# EAGLE schematic PDNode-600 Pro (EAGLE 9.2.1), part 2 of 2
## Sheet 10 of 12: USB-C PD SOURCE PORT6
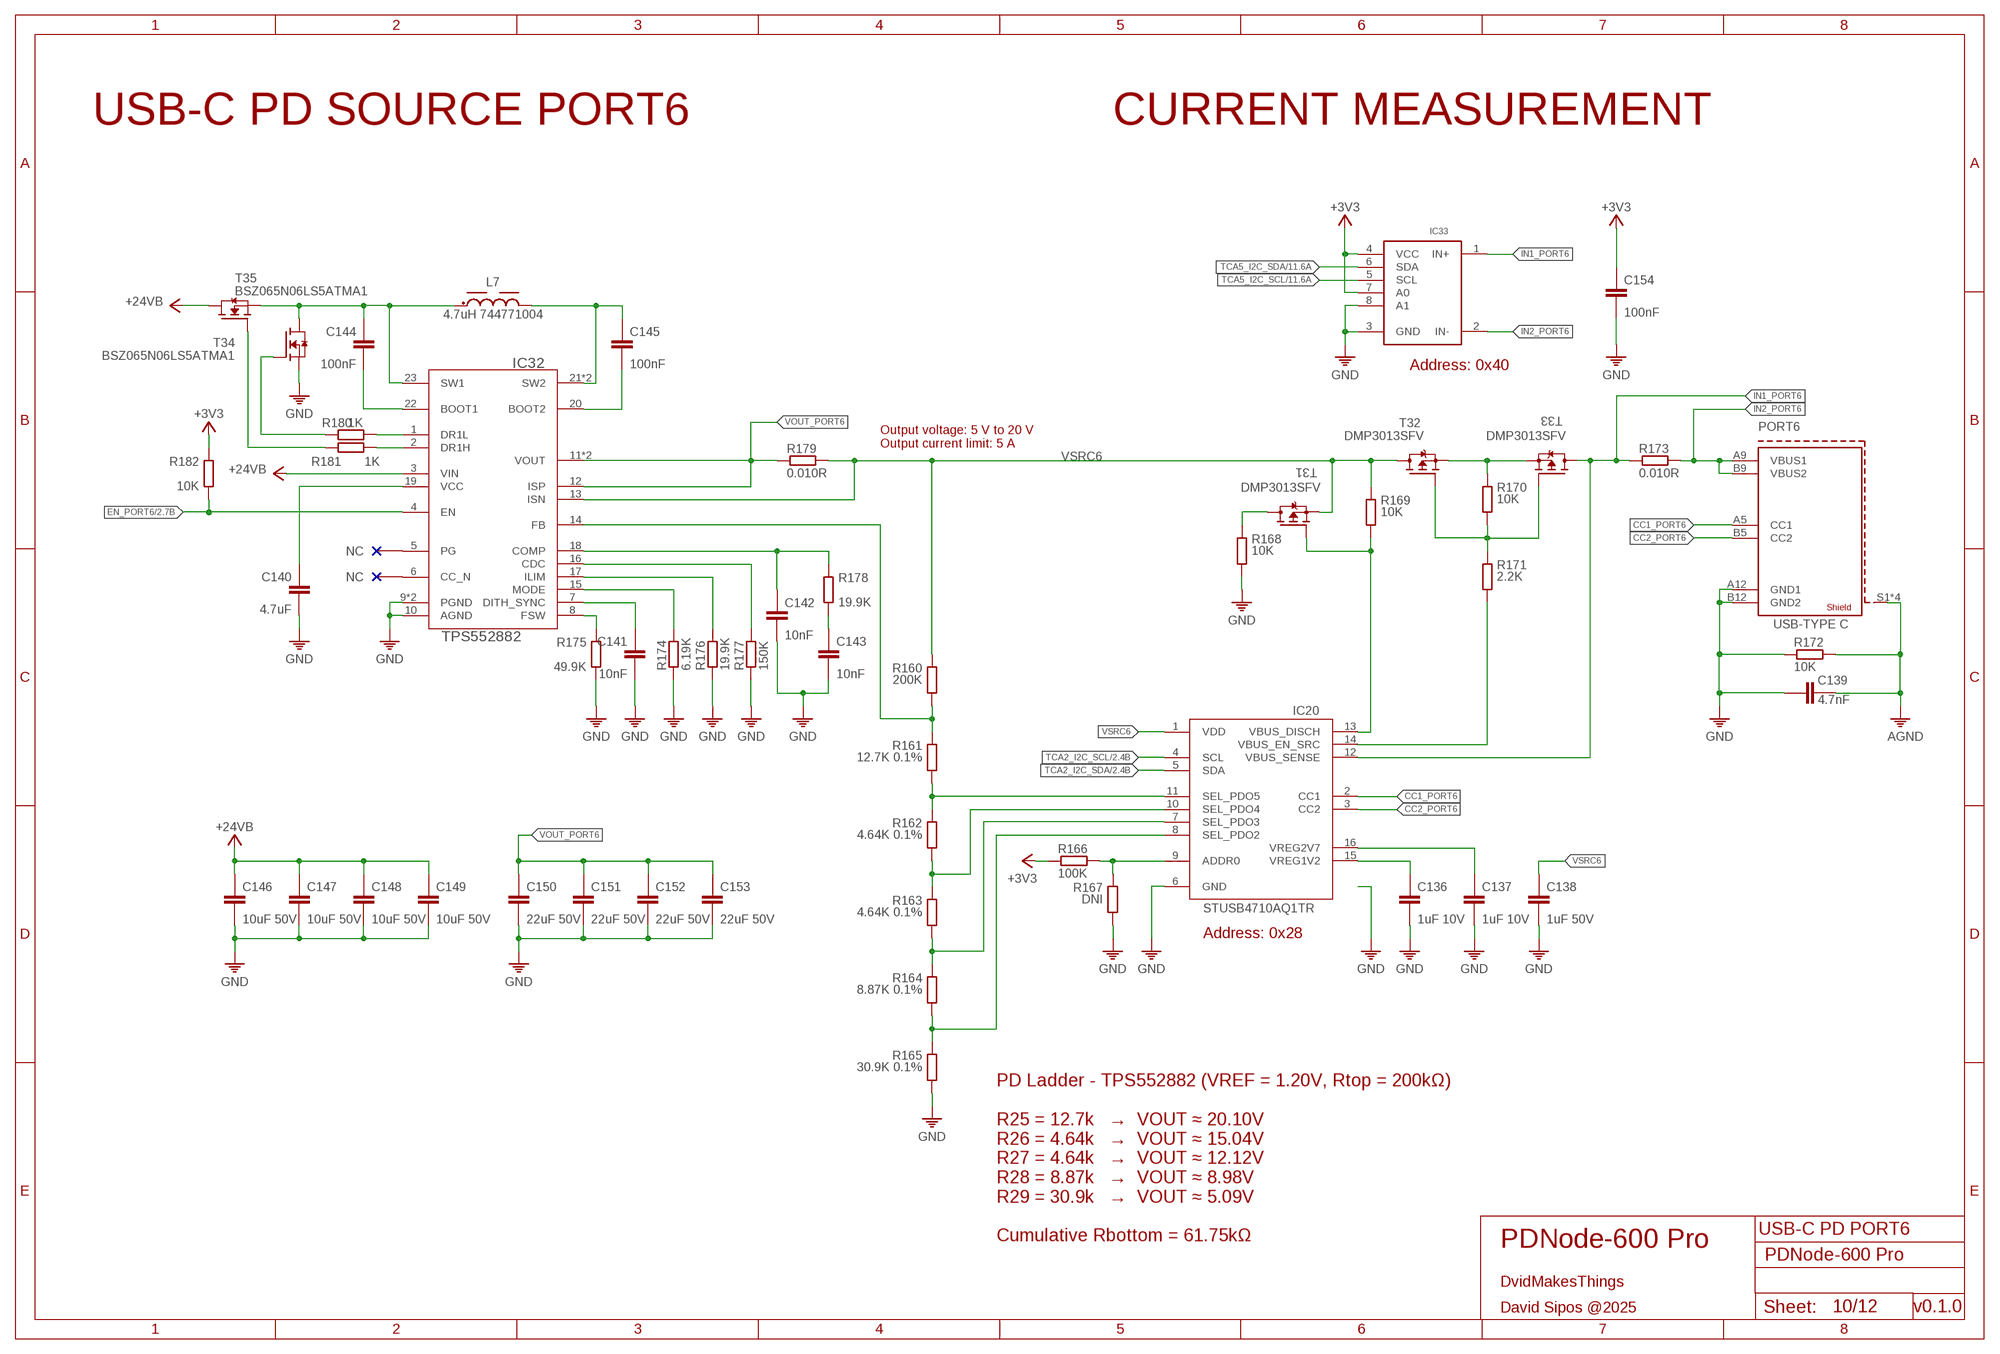
[diagram p9: schematic, sheet 10]

### Parts
C136  1uF 10V  C-0201  [0201]
C137  1uF 10V  C-0201  [0201]
C138  1uF 50V  C-0603  [C0603]
C139  4.7nF  C-0402  [C0402]
C140  4.7uF  C-0402  [C0402]
C141  10nF  C-0201  [0201]
C142  10nF  C-0201  [0201]
C143  10nF  C-0201  [0201]
C144  100nF  C-0402  [C0402]
C145  100nF  C-0402  [C0402]
C146  10uF 50V  C-0805  [C0805]
C147  10uF 50V  C-0805  [C0805]
C148  10uF 50V  C-0805  [C0805]
C149  10uF 50V  C-0805  [C0805]
C150  22uF 50V  C-0805  [C0805]
C151  22uF 50V  C-0805  [C0805]
C152  22uF 50V  C-0805  [C0805]
C153  22uF 50V  C-0805  [C0805]
C154  100nF  C-0201  [0201]
IC20  STUSB4710AQ1TR  [QFN50P300X300X55-16N]
IC32  TPS552882  [RPM0026A-MFG]
IC33  INA219BIDCNT  [SOT23-8]
L7  4.7uH 744771004  WE-PD_1280_74477004  [WE-PD_1280]
PORT6  632722100213  [632722100213]
R160  200K  R0201  [R0201]
R161  12.7K 0.1%  R0201  [R0201]
R162  4.64K 0.1%  R0201  [R0201]
R163  4.64K 0.1%  R0201  [R0201]
R164  8.87K 0.1%  R0201  [R0201]
R165  30.9K 0.1%  R0201  [R0201]
R166  100K  R0201  [R0201]
R167  DNI  R0201  [R0201]
R168  10K  R0402  [0402]
R169  10K  R0402  [0402]
R170  10K  R0201  [R0201]
R171  2.2K  R0201  [R0201]
R172  10K  R0402  [0402]
R173  0.010R  R2512  [2512]
R174  6.19K  R0201  [R0201]
R175  49.9K  R0201  [R0201]
R176  19.9K  R0201  [R0201]
R177  150K  R0201  [R0201]
R178  19.9K  R0201  [R0201]
R179  0.010R  R2512  [2512]
R180  1K  R0201  [R0201]
R181  1K  R0201  [R0201]
R182  10K  R0201  [R0201]
T31  DMP3013SFV  DMP3013SFV-7UX  [POWERDI3333-8_UX_DIO-L]
T32  DMP3013SFV  DMP3013SFV-7UX  [POWERDI3333-8_UX_DIO-L]
T33  DMP3013SFV  DMP3013SFV-7UX  [POWERDI3333-8_UX_DIO-L]
T34  BSZ065N06LS5ATMA1  IPZ40N04S5L7R4ATMA1  [POWERDI3333-8_UX_DIO-L]
T35  BSZ065N06LS5ATMA1  IPZ40N04S5L7R4ATMA1  [POWERDI3333-8_UX_DIO-L]

### Nets
+3V3: C154.1 IC33.4(VCC) IC33.7(A0) R166.1 R182.1 ; also sheet 1,2,3,4,5,6,7,8,9,11,12
+24V_B: C146.1 C147.1 C148.1 C149.1 IC32.3(VIN) T35.5(D) T35.6(D) T35.7(D) T35.8(D) T35.9(D) ; supply symbol labelled +24VB ; also sheet 3,9,11,12
AGND: C139.2 PORT6.S1(SHIELD1) PORT6.S2(SHIELD1) PORT6.S3(SHIELD1) PORT6.S4(SHIELD1) R172.2 ; also sheet 1,2,4,5,6,7,8,9,11,12
CC1_PORT6: IC20.2(CC1) PORT6.A5(CC1)
CC2_PORT6: IC20.3(CC2) PORT6.B5(CC2)
EN_PORT6: IC32.4(EN) R182.2 ; also sheet 2
GND: C136.2 C137.2 C138.2 C139.1 C140.2 C141.2 C142.2 C143.2 C146.2 C147.2 C148.2 C149.2 C150.2 C151.2 C152.2 C153.2 C154.2 IC20.6(GND) IC32.9(PGND) IC32.10(AGND) IC32.24(PGND) IC33.3(GND) IC33.8(A1) PORT6.A12(GND1) PORT6.B12(GND2) R165.2 R167.2 R168.2 R172.1 R174.2 R175.2 R176.2 R177.2 T34.1(S) T34.2(S) T34.3(S) ; also sheet 1,2,3,4,5,6,7,8,9,11,12
IN1_PORT6: IC20.12(VBUS_SENSE) IC33.1(IN+) R173.1 T33.5(D) T33.6(D) T33.7(D) T33.8(D) T33.9(D)
IN2_PORT6: IC33.2(IN-) PORT6.A9(VBUS1) PORT6.B9(VBUS2) R173.2
N$192: IC32.14(FB) R160.2 R161.1
N$193: IC20.11(SEL_PDO5) R161.2 R162.1
N$194: IC20.10(SEL_PDO4) R162.2 R163.1
N$195: IC20.7(SEL_PDO3) R163.2 R164.1
N$196: IC20.8(SEL_PDO2) R164.2 R165.1
N$197: C136.1 IC20.15(VREG1V2)
N$198: C137.1 IC20.16(VREG2V7)
N$199: IC20.9(ADDR0) R166.2 R167.1
N$200: R168.1 T31.5(D) T31.6(D) T31.7(D) T31.8(D) T31.9(D)
N$201: IC20.13(VBUS_DISCH) R169.2 T31.4(G)
N$202: R170.1 T32.1(S) T32.2(S) T32.3(S) T33.1(S) T33.2(S) T33.3(S)
N$203: R170.2 R171.1 T32.4(G) T33.4(G)
N$204: IC20.14(VBUS_EN_SRC) R171.2
N$205: C143.1 R178.2
N$206: IC32.8(FSW) R175.1
N$207: C141.1 IC32.7(DITH_SYNC)
N$208: IC32.15(MODE) R174.1
N$209: IC32.17(ILIM) R176.1
N$210: IC32.16(CDC) R177.1
N$211: C142.1 IC32.18(COMP) R178.1
N$212: C140.1 IC32.19(VCC)
N$213: C144.1 IC32.23(SW1) L7.1 T34.5(D) T34.6(D) T34.7(D) T34.8(D) T34.9(D) T35.1(S) T35.2(S) T35.3(S)
N$214: C145.1 IC32.21(SW2) IC32.25(SW2) L7.2
N$215: C144.2 IC32.22(BOOT1)
N$216: C145.2 IC32.20(BOOT2)
N$217: R181.2 T35.4(G)
N$218: R180.2 T34.4(G)
N$219: IC32.1(DR1L) R180.1
N$220: IC32.2(DR1H) R181.1
TCA2_I2C_SCL: IC20.4(SCL) ; also sheet 2,9
TCA2_I2C_SDA: IC20.5(SDA) ; also sheet 2,9
TCA5_I2C_SCL: IC33.5(SCL) ; also sheet 2,9,11,12
TCA5_I2C_SDA: IC33.6(SDA) ; also sheet 2,9,11,12
VOUT_PORT6: C150.1 C151.1 C152.1 C153.1 IC32.11(VOUT) IC32.12(ISP) IC32.26(VOUT) R179.1
VSRC6: C138.1 IC20.1(VDD) IC32.13(ISN) R160.1 R169.1 R179.2 T31.1(S) T31.2(S) T31.3(S) T32.5(D) T32.6(D) T32.7(D) T32.8(D) T32.9(D)
Unconnected: IC32.5(PG) IC32.6(CC_N)

### Notes on the sheet
- USB-C PD SOURCE PORT6 | CURRENT MEASUREMENT
- Address: 0x40
- Output voltage: 5 V to 20 V
  Output current limit: 5 A
- Address: 0x28
- USB-C PD PORT6
- PDNode-600 Pro
- PD Ladder - TPS552882 (VREF = 1.20V, Rtop = 200kΩ)
  
  R25 = 12.7k   →  VOUT ≈ 20.10V
  R26 = 4.64k   →  VOUT ≈ 15.04V
  R27 = 4.64k   →  VOUT ≈ 12.12V
  R28 = 8.87k   →  VOUT ≈ 8.98V
  R29 = 30.9k   →  VOUT ≈ 5.09V
  
  Cumulative Rbottom = 61.75kΩ
- DvidMakesThings
- David Sipos @2025 | v0.1.0

## Sheet 11 of 12: USB-C PD SOURCE PORT7
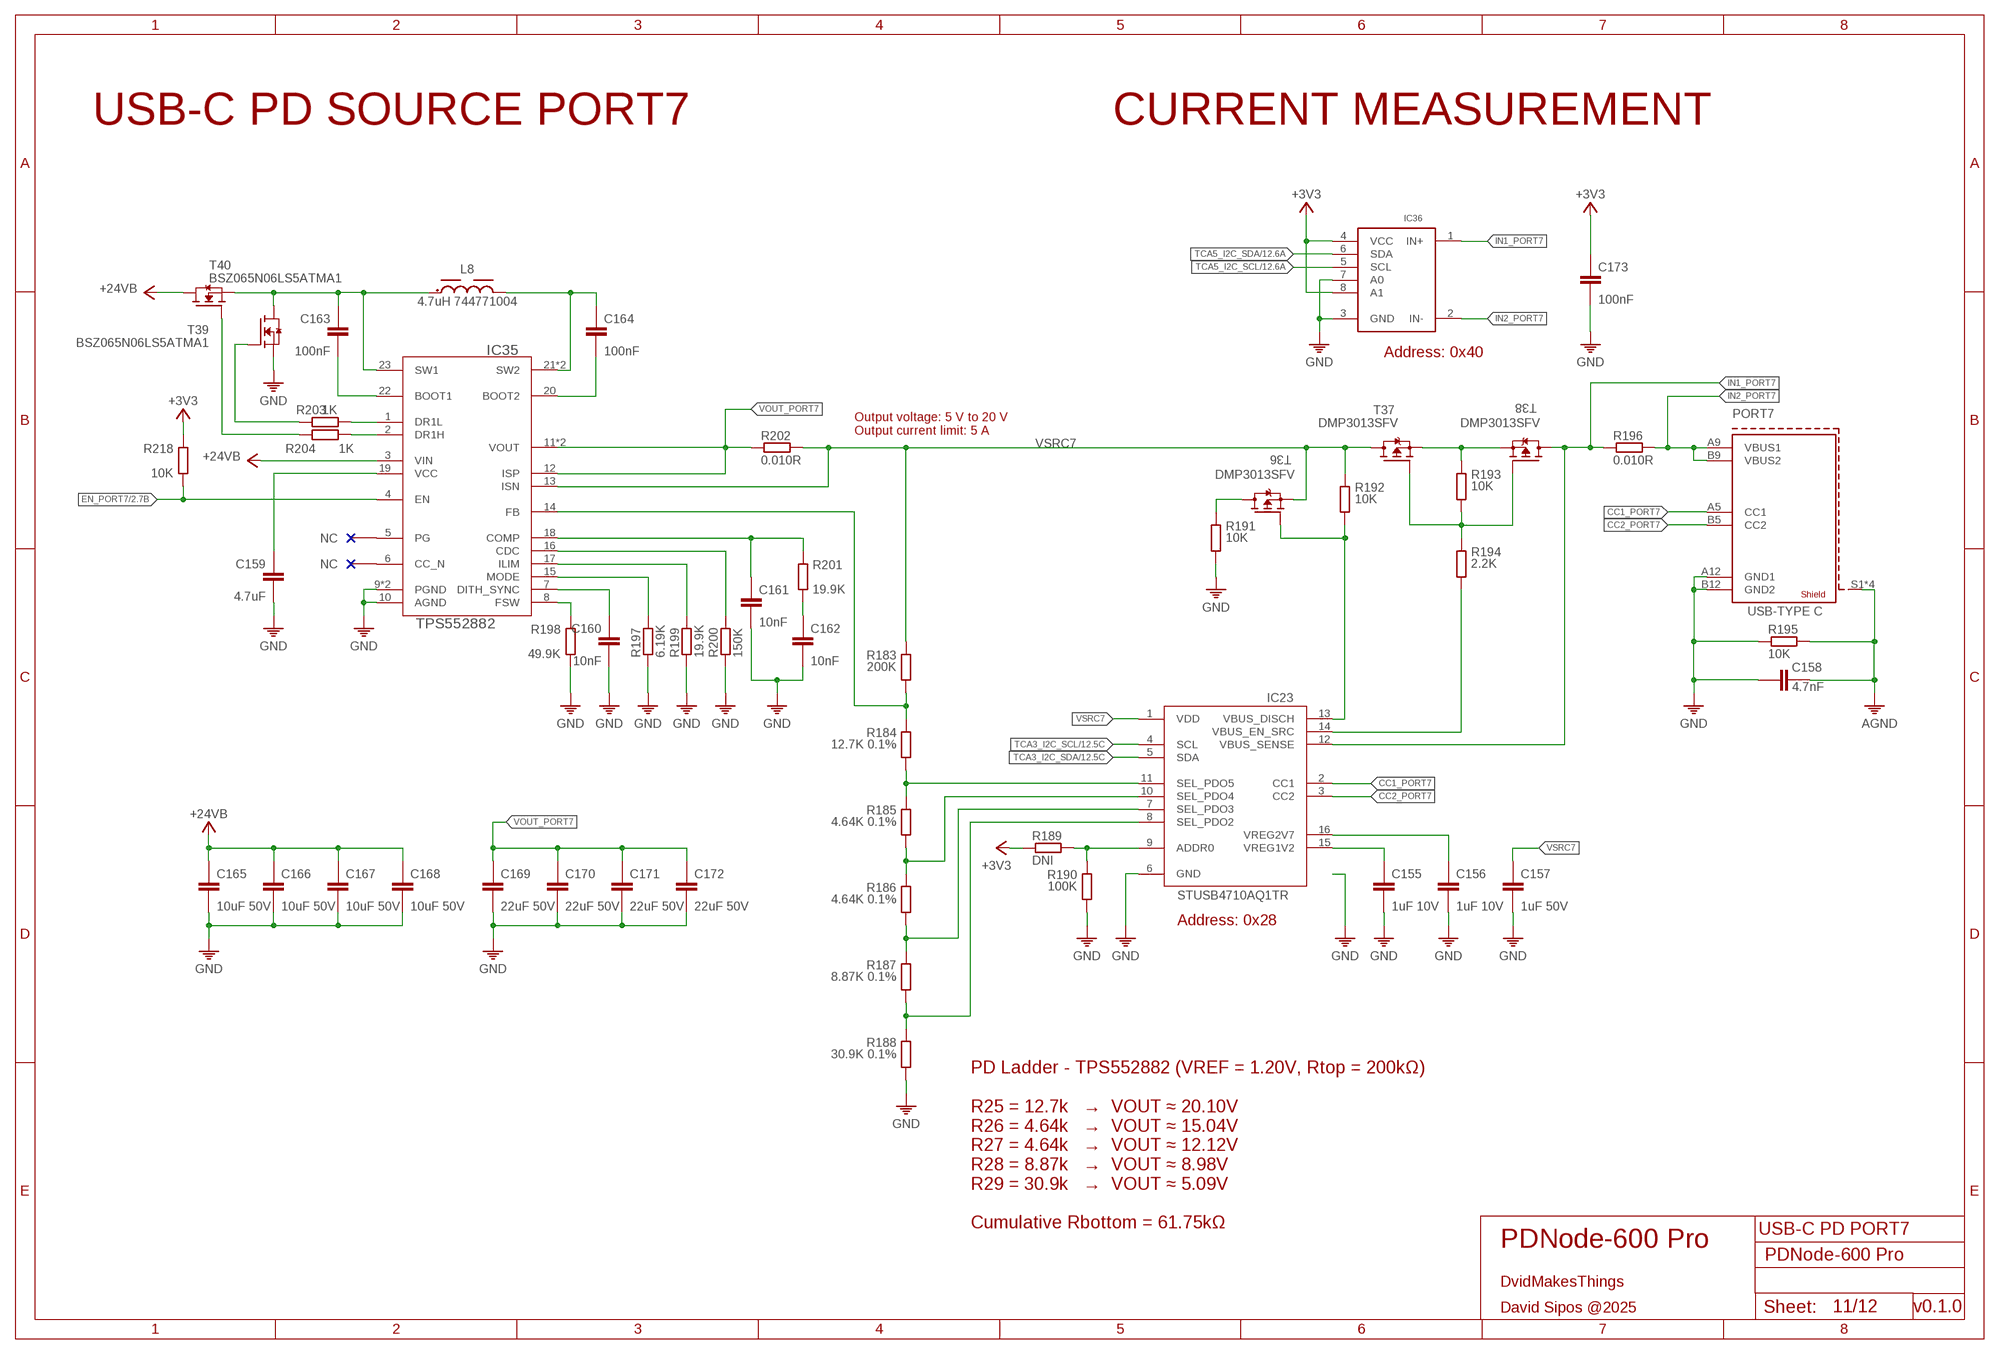
[diagram p10: schematic, sheet 11]

### Parts
C155  1uF 10V  C-0201  [0201]
C156  1uF 10V  C-0201  [0201]
C157  1uF 50V  C-0603  [C0603]
C158  4.7nF  C-0402  [C0402]
C159  4.7uF  C-0402  [C0402]
C160  10nF  C-0201  [0201]
C161  10nF  C-0201  [0201]
C162  10nF  C-0201  [0201]
C163  100nF  C-0402  [C0402]
C164  100nF  C-0402  [C0402]
C165  10uF 50V  C-0805  [C0805]
C166  10uF 50V  C-0805  [C0805]
C167  10uF 50V  C-0805  [C0805]
C168  10uF 50V  C-0805  [C0805]
C169  22uF 50V  C-0805  [C0805]
C170  22uF 50V  C-0805  [C0805]
C171  22uF 50V  C-0805  [C0805]
C172  22uF 50V  C-0805  [C0805]
C173  100nF  C-0201  [0201]
IC23  STUSB4710AQ1TR  [QFN50P300X300X55-16N]
IC35  TPS552882  [RPM0026A-MFG]
IC36  INA219BIDCNT  [SOT23-8]
L8  4.7uH 744771004  WE-PD_1280_74477004  [WE-PD_1280]
PORT7  632722100213  [632722100213]
R183  200K  R0201  [R0201]
R184  12.7K 0.1%  R0201  [R0201]
R185  4.64K 0.1%  R0201  [R0201]
R186  4.64K 0.1%  R0201  [R0201]
R187  8.87K 0.1%  R0201  [R0201]
R188  30.9K 0.1%  R0201  [R0201]
R189  DNI  R0201  [R0201]
R190  100K  R0201  [R0201]
R191  10K  R0402  [0402]
R192  10K  R0402  [0402]
R193  10K  R0201  [R0201]
R194  2.2K  R0201  [R0201]
R195  10K  R0402  [0402]
R196  0.010R  R2512  [2512]
R197  6.19K  R0201  [R0201]
R198  49.9K  R0201  [R0201]
R199  19.9K  R0201  [R0201]
R200  150K  R0201  [R0201]
R201  19.9K  R0201  [R0201]
R202  0.010R  R2512  [2512]
R203  1K  R0201  [R0201]
R204  1K  R0201  [R0201]
R218  10K  R0201  [R0201]
T36  DMP3013SFV  DMP3013SFV-7UX  [POWERDI3333-8_UX_DIO-L]
T37  DMP3013SFV  DMP3013SFV-7UX  [POWERDI3333-8_UX_DIO-L]
T38  DMP3013SFV  DMP3013SFV-7UX  [POWERDI3333-8_UX_DIO-L]
T39  BSZ065N06LS5ATMA1  IPZ40N04S5L7R4ATMA1  [POWERDI3333-8_UX_DIO-L]
T40  BSZ065N06LS5ATMA1  IPZ40N04S5L7R4ATMA1  [POWERDI3333-8_UX_DIO-L]

### Nets
+3V3: C173.1 IC36.4(VCC) IC36.8(A1) R189.1 R218.1 ; also sheet 1,2,3,4,5,6,7,8,9,10,12
+24V_B: C165.1 C166.1 C167.1 C168.1 IC35.3(VIN) T40.5(D) T40.6(D) T40.7(D) T40.8(D) T40.9(D) ; supply symbol labelled +24VB ; also sheet 3,9,10,12
AGND: C158.2 PORT7.S1(SHIELD1) PORT7.S2(SHIELD1) PORT7.S3(SHIELD1) PORT7.S4(SHIELD1) R195.2 ; also sheet 1,2,4,5,6,7,8,9,10,12
CC1_PORT7: IC23.2(CC1) PORT7.A5(CC1)
CC2_PORT7: IC23.3(CC2) PORT7.B5(CC2)
EN_PORT7: IC35.4(EN) R218.2 ; also sheet 2
GND: C155.2 C156.2 C157.2 C158.1 C159.2 C160.2 C161.2 C162.2 C165.2 C166.2 C167.2 C168.2 C169.2 C170.2 C171.2 C172.2 C173.2 IC23.6(GND) IC35.9(PGND) IC35.10(AGND) IC35.24(PGND) IC36.3(GND) IC36.7(A0) PORT7.A12(GND1) PORT7.B12(GND2) R188.2 R190.2 R191.2 R195.1 R197.2 R198.2 R199.2 R200.2 T39.1(S) T39.2(S) T39.3(S) ; also sheet 1,2,3,4,5,6,7,8,9,10,12
IN1_PORT7: IC23.12(VBUS_SENSE) IC36.1(IN+) R196.1 T38.5(D) T38.6(D) T38.7(D) T38.8(D) T38.9(D)
IN2_PORT7: IC36.2(IN-) PORT7.A9(VBUS1) PORT7.B9(VBUS2) R196.2
N$221: IC35.14(FB) R183.2 R184.1
N$223: IC23.11(SEL_PDO5) R184.2 R185.1
N$224: IC23.10(SEL_PDO4) R185.2 R186.1
N$225: IC23.7(SEL_PDO3) R186.2 R187.1
N$226: IC23.8(SEL_PDO2) R187.2 R188.1
N$227: C155.1 IC23.15(VREG1V2)
N$228: C156.1 IC23.16(VREG2V7)
N$229: IC23.9(ADDR0) R189.2 R190.1
N$230: R191.1 T36.5(D) T36.6(D) T36.7(D) T36.8(D) T36.9(D)
N$231: IC23.13(VBUS_DISCH) R192.2 T36.4(G)
N$232: R193.1 T37.1(S) T37.2(S) T37.3(S) T38.1(S) T38.2(S) T38.3(S)
N$233: R193.2 R194.1 T37.4(G) T38.4(G)
N$234: IC23.14(VBUS_EN_SRC) R194.2
N$235: C162.1 R201.2
N$236: IC35.8(FSW) R198.1
N$237: C160.1 IC35.7(DITH_SYNC)
N$238: IC35.15(MODE) R197.1
N$239: IC35.17(ILIM) R199.1
N$240: IC35.16(CDC) R200.1
N$241: C161.1 IC35.18(COMP) R201.1
N$242: C159.1 IC35.19(VCC)
N$243: C163.1 IC35.23(SW1) L8.1 T39.5(D) T39.6(D) T39.7(D) T39.8(D) T39.9(D) T40.1(S) T40.2(S) T40.3(S)
N$244: C164.1 IC35.21(SW2) IC35.25(SW2) L8.2
N$245: C163.2 IC35.22(BOOT1)
N$246: C164.2 IC35.20(BOOT2)
N$247: R204.2 T40.4(G)
N$248: R203.2 T39.4(G)
N$249: IC35.1(DR1L) R203.1
N$250: IC35.2(DR1H) R204.1
TCA3_I2C_SCL: IC23.4(SCL) ; also sheet 2,12
TCA3_I2C_SDA: IC23.5(SDA) ; also sheet 2,12
TCA5_I2C_SCL: IC36.5(SCL) ; also sheet 2,9,10,12
TCA5_I2C_SDA: IC36.6(SDA) ; also sheet 2,9,10,12
VOUT_PORT7: C169.1 C170.1 C171.1 C172.1 IC35.11(VOUT) IC35.12(ISP) IC35.26(VOUT) R202.1
VSRC7: C157.1 IC23.1(VDD) IC35.13(ISN) R183.1 R192.1 R202.2 T36.1(S) T36.2(S) T36.3(S) T37.5(D) T37.6(D) T37.7(D) T37.8(D) T37.9(D)
Unconnected: IC35.5(PG) IC35.6(CC_N)

### Notes on the sheet
- USB-C PD SOURCE PORT7 | CURRENT MEASUREMENT
- Address: 0x40
- Output voltage: 5 V to 20 V
  Output current limit: 5 A
- Address: 0x28
- USB-C PD PORT7
- PD Ladder - TPS552882 (VREF = 1.20V, Rtop = 200kΩ)
  
  R25 = 12.7k   →  VOUT ≈ 20.10V
  R26 = 4.64k   →  VOUT ≈ 15.04V
  R27 = 4.64k   →  VOUT ≈ 12.12V
  R28 = 8.87k   →  VOUT ≈ 8.98V
  R29 = 30.9k   →  VOUT ≈ 5.09V
  
  Cumulative Rbottom = 61.75kΩ
- PDNode-600 Pro
- DvidMakesThings
- David Sipos @2025 | v0.1.0

## Sheet 12 of 12: USB-C PD SOURCE PORT8
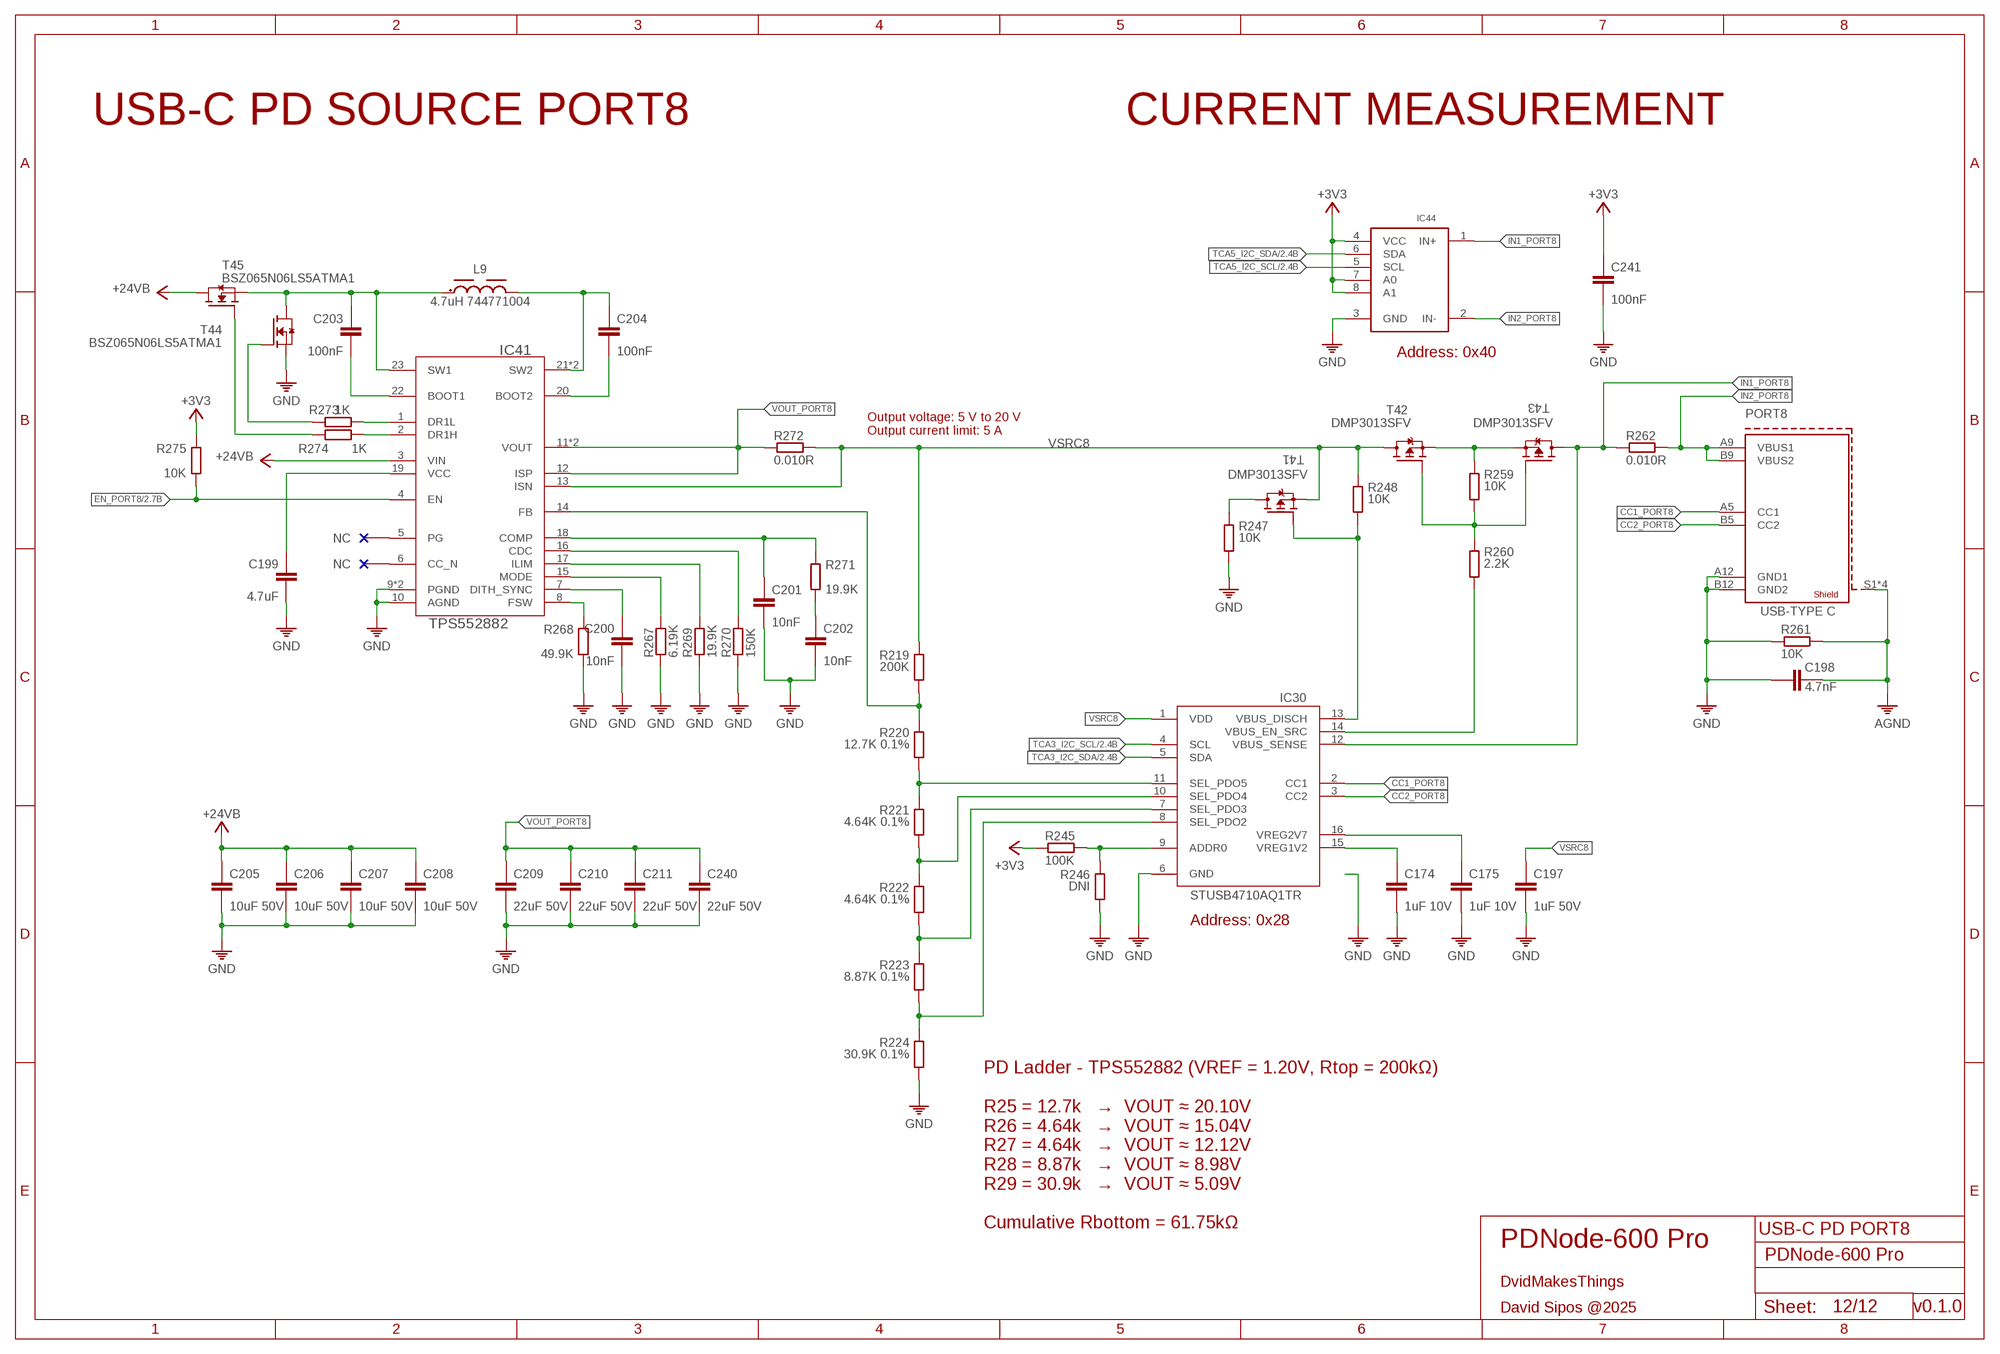
[diagram p11: schematic, sheet 12]

### Parts
C174  1uF 10V  C-0201  [0201]
C175  1uF 10V  C-0201  [0201]
C197  1uF 50V  C-0603  [C0603]
C198  4.7nF  C-0402  [C0402]
C199  4.7uF  C-0402  [C0402]
C200  10nF  C-0201  [0201]
C201  10nF  C-0201  [0201]
C202  10nF  C-0201  [0201]
C203  100nF  C-0402  [C0402]
C204  100nF  C-0402  [C0402]
C205  10uF 50V  C-0805  [C0805]
C206  10uF 50V  C-0805  [C0805]
C207  10uF 50V  C-0805  [C0805]
C208  10uF 50V  C-0805  [C0805]
C209  22uF 50V  C-0805  [C0805]
C210  22uF 50V  C-0805  [C0805]
C211  22uF 50V  C-0805  [C0805]
C240  22uF 50V  C-0805  [C0805]
C241  100nF  C-0201  [0201]
IC30  STUSB4710AQ1TR  [QFN50P300X300X55-16N]
IC41  TPS552882  [RPM0026A-MFG]
IC44  INA219BIDCNT  [SOT23-8]
L9  4.7uH 744771004  WE-PD_1280_74477004  [WE-PD_1280]
PORT8  632722100213  [632722100213]
R219  200K  R0201  [R0201]
R220  12.7K 0.1%  R0201  [R0201]
R221  4.64K 0.1%  R0201  [R0201]
R222  4.64K 0.1%  R0201  [R0201]
R223  8.87K 0.1%  R0201  [R0201]
R224  30.9K 0.1%  R0201  [R0201]
R245  100K  R0201  [R0201]
R246  DNI  R0201  [R0201]
R247  10K  R0402  [0402]
R248  10K  R0402  [0402]
R259  10K  R0201  [R0201]
R260  2.2K  R0201  [R0201]
R261  10K  R0402  [0402]
R262  0.010R  R2512  [2512]
R267  6.19K  R0201  [R0201]
R268  49.9K  R0201  [R0201]
R269  19.9K  R0201  [R0201]
R270  150K  R0201  [R0201]
R271  19.9K  R0201  [R0201]
R272  0.010R  R2512  [2512]
R273  1K  R0201  [R0201]
R274  1K  R0201  [R0201]
R275  10K  R0201  [R0201]
T41  DMP3013SFV  DMP3013SFV-7UX  [POWERDI3333-8_UX_DIO-L]
T42  DMP3013SFV  DMP3013SFV-7UX  [POWERDI3333-8_UX_DIO-L]
T43  DMP3013SFV  DMP3013SFV-7UX  [POWERDI3333-8_UX_DIO-L]
T44  BSZ065N06LS5ATMA1  IPZ40N04S5L7R4ATMA1  [POWERDI3333-8_UX_DIO-L]
T45  BSZ065N06LS5ATMA1  IPZ40N04S5L7R4ATMA1  [POWERDI3333-8_UX_DIO-L]

### Nets
+3V3: C241.1 IC44.4(VCC) IC44.7(A0) IC44.8(A1) R245.1 R275.1 ; also sheet 1,2,3,4,5,6,7,8,9,10,11
+24V_B: C205.1 C206.1 C207.1 C208.1 IC41.3(VIN) T45.5(D) T45.6(D) T45.7(D) T45.8(D) T45.9(D) ; supply symbol labelled +24VB ; also sheet 3,9,10,11
AGND: C198.2 PORT8.S1(SHIELD1) PORT8.S2(SHIELD1) PORT8.S3(SHIELD1) PORT8.S4(SHIELD1) R261.2 ; also sheet 1,2,4,5,6,7,8,9,10,11
CC1_PORT8: IC30.2(CC1) PORT8.A5(CC1)
CC2_PORT8: IC30.3(CC2) PORT8.B5(CC2)
EN_PORT8: IC41.4(EN) R275.2 ; also sheet 2
GND: C174.2 C175.2 C197.2 C198.1 C199.2 C200.2 C201.2 C202.2 C205.2 C206.2 C207.2 C208.2 C209.2 C210.2 C211.2 C240.2 C241.2 IC30.6(GND) IC41.9(PGND) IC41.10(AGND) IC41.24(PGND) IC44.3(GND) PORT8.A12(GND1) PORT8.B12(GND2) R224.2 R246.2 R247.2 R261.1 R267.2 R268.2 R269.2 R270.2 T44.1(S) T44.2(S) T44.3(S) ; also sheet 1,2,3,4,5,6,7,8,9,10,11
IN1_PORT8: IC30.12(VBUS_SENSE) IC44.1(IN+) R262.1 T43.5(D) T43.6(D) T43.7(D) T43.8(D) T43.9(D)
IN2_PORT8: IC44.2(IN-) PORT8.A9(VBUS1) PORT8.B9(VBUS2) R262.2
N$251: IC41.14(FB) R219.2 R220.1
N$253: IC30.11(SEL_PDO5) R220.2 R221.1
N$254: IC30.10(SEL_PDO4) R221.2 R222.1
N$255: IC30.7(SEL_PDO3) R222.2 R223.1
N$256: IC30.8(SEL_PDO2) R223.2 R224.1
N$262: C174.1 IC30.15(VREG1V2)
N$263: C175.1 IC30.16(VREG2V7)
N$264: IC30.9(ADDR0) R245.2 R246.1
N$265: R247.1 T41.5(D) T41.6(D) T41.7(D) T41.8(D) T41.9(D)
N$266: IC30.13(VBUS_DISCH) R248.2 T41.4(G)
N$272: R259.1 T42.1(S) T42.2(S) T42.3(S) T43.1(S) T43.2(S) T43.3(S)
N$273: R259.2 R260.1 T42.4(G) T43.4(G)
N$274: IC30.14(VBUS_EN_SRC) R260.2
N$277: C202.1 R271.2
N$278: IC41.8(FSW) R268.1
N$279: C200.1 IC41.7(DITH_SYNC)
N$280: IC41.15(MODE) R267.1
N$281: IC41.17(ILIM) R269.1
N$282: IC41.16(CDC) R270.1
N$283: C201.1 IC41.18(COMP) R271.1
N$284: C199.1 IC41.19(VCC)
N$285: C203.1 IC41.23(SW1) L9.1 T44.5(D) T44.6(D) T44.7(D) T44.8(D) T44.9(D) T45.1(S) T45.2(S) T45.3(S)
N$286: C204.1 IC41.21(SW2) IC41.25(SW2) L9.2
N$287: C203.2 IC41.22(BOOT1)
N$295: C204.2 IC41.20(BOOT2)
N$296: R274.2 T45.4(G)
N$297: R273.2 T44.4(G)
N$298: IC41.1(DR1L) R273.1
N$299: IC41.2(DR1H) R274.1
TCA3_I2C_SCL: IC30.4(SCL) ; also sheet 2,11
TCA3_I2C_SDA: IC30.5(SDA) ; also sheet 2,11
TCA5_I2C_SCL: IC44.5(SCL) ; also sheet 2,9,10,11
TCA5_I2C_SDA: IC44.6(SDA) ; also sheet 2,9,10,11
VOUT_PORT8: C209.1 C210.1 C211.1 C240.1 IC41.11(VOUT) IC41.12(ISP) IC41.26(VOUT) R272.1
VSRC8: C197.1 IC30.1(VDD) IC41.13(ISN) R219.1 R248.1 R272.2 T41.1(S) T41.2(S) T41.3(S) T42.5(D) T42.6(D) T42.7(D) T42.8(D) T42.9(D)
Unconnected: IC41.5(PG) IC41.6(CC_N)

### Notes on the sheet
- USB-C PD SOURCE PORT8 | CURRENT MEASUREMENT
- Address: 0x40
- Output voltage: 5 V to 20 V
  Output current limit: 5 A
- Address: 0x28
- USB-C PD PORT8
- PD Ladder - TPS552882 (VREF = 1.20V, Rtop = 200kΩ)
  
  R25 = 12.7k   →  VOUT ≈ 20.10V
  R26 = 4.64k   →  VOUT ≈ 15.04V
  R27 = 4.64k   →  VOUT ≈ 12.12V
  R28 = 8.87k   →  VOUT ≈ 8.98V
  R29 = 30.9k   →  VOUT ≈ 5.09V
  
  Cumulative Rbottom = 61.75kΩ
- PDNode-600 Pro
- DvidMakesThings
- David Sipos @2025 | v0.1.0

## Library data of the parts
AVDD DVDD GND IOVDD VO3 VO5A VO5B VREF = ds_passive:TP
BOOT RESET = Wurth_Switch_WS-TASV:430182050816: WS-TASV SMT Tact Switch 6x6 mm Material Properties Cover Material : Stainless Steel Properties Actuator Material:LCP Actuator Flammability :UL94 V-0 Rating Actuator Color:Black; Salmon; White Frame Material:LCP Flammability Rating:UL94 V-0 Frame Color:Black Contact Material:Stainless Steel Contact Plating:Silver Terminal Material:Copper Alloy Terminal Plating:Silver VR:12 V (DC) Contact Resistance Initial:100 mΩ Contact Resistance After Life Test:2Ω RISO:100 MΩ Withstanding Voltage:250 V (AC) Washable:No Qty.:4000;5000 Mechanical Properties Electrical Life:400; 550; 1000 Stroke :0.25 mm General Information Operating Temperature:-40 up to +85 °C Washable:No Packaging Properties Packaging:Tape and Reel <https://www.we-online.com/catalog/media/o37470v209%20Family_WS-TASV_6x6mm_SMD_Tact_Switch_4301820xx8xx.jpg> Details see: https://www.we-online.com/catalog/en/TASV_6X6_SMD/ Updated by yingchun,Shan;2020-02-18 2020(C) Würth Elektronik; DATASHEET-URL: https://www.we-online.com/redexpert/spec/430182050816?ae; HEIGHT: 5mm; OPERATION-FORCE: 160g; PART-NUMBER: 430182050816; QTY: 1000; VALUE: 430182050816
C1-C4 C6-C9 C11-C14 C16-C20 C39-C84 C86-C195 C197-C241 C247-C251 C258-C264 C272-C278 = ds_passive:C
C5 C10 C15 C85 = ds_passive:CPOL
C252-C257 = Capacitor:C-POL: Capacitor Polarised - Generic; CATEGORY: Capacitor; PACKAGE_SIZE: 8.5MM; PACKAGE_TYPE: SMD; SUBCATEGORY: Aluminum Electrolytic Capacitors; TYPE: Radial Can
D1 D3 D5 D7 = LED:CHIP-FLAT-G: Green LED - Generic; CATEGORY: LED; COLOR: Green; DESCRIPTION: Green LED Indication 0603 (1608 Metric); PACKAGE_SIZE: 0603; PACKAGE_TYPE: SMD; SUBCATEGORY: Chip LED; TYPE: Square with Flat Top
D2 D4 D6 D8 = LED:CHIP-FLAT-R: Red LED - Generic; CATEGORY: LED; COLOR: Red; DESCRIPTION: Red LED Indication 0603 (1608 Metric); PACKAGE_SIZE: 0603; PACKAGE_TYPE: SMD; SUBCATEGORY: Chip LED; TYPE: Square with Flat Top
D9-D11 = diode:DIODE-: DIODE
DISP = ds_con:AFC11-S20ICC-00
ESD1 = ds_ic_peripherals:SP0503BAHT: TVS Diode Arrays Surface Mount TVS Avalanche Diode Array
ETH1 = ds_con:RJ45-CAT5; MANUFACTURER: Bel Fuse; MAXIMUM_PACKAGE_HEIGHT: 15.21mm; PARTREV: A0; STANDARD: Manufacturer Recommendations
F1-F3 = ds_passive:BLADE-FUSE; MANUFACTURER: Keystone; MAXIMUM_PACKAGE_HEIGHT: 9.02mm; PARTREV: C; SNAPEDA_PN: 3544-2; STANDARD: Manufacturer Recommendations
H1-H4 = holes:MOUNT-PAD-ROUND: MOUNTING PAD, round
IC1-IC3 IC8 = ds_ic_peripherals:AP22653W6: PRECISION ADJUSTABLE CURRENT-LIMITED POWER SWITCHES; DATASHEET: https://www.diodes.com/assets/Datasheets/AP22652_53_52A_53A.pdf
IC4-IC7 = ds_ic_logic:74LVC1G04: Single inverter
IC9-IC11 IC14 IC17 IC20 IC23 IC30 = ds_ic_peripherals:STUSB4710: Stand-alone USB PD controller (with short-to-VBUS protection)
IC12 IC15 IC18 IC21 IC24 IC32 IC35 IC41 = ds_ic_vreg:TPS552882; COPYRIGHT: Copyright (C) 2025 Ultra Librarian. All rights reserved.; DATASHEET: https://www.ti.com/lit/ds/symlink/tps552882-q1.pdf?ts=1746222078398&ref_url=https%253A%252F%252Fwww.ti.com%252Fproduct%252FTPS552882-Q1; MANUFACTURER_PART_NUMBER: TPS552882QRPMRQ1; MFR_NAME: Texas Instruments; REFDES: RefDes; TYPE: TYPE
IC13 IC16 IC19 IC22 IC25 IC33 IC36 IC44 = ds_ic_peripherals:INA219: 26-V 12-bit I2C output digital power monitor; DATASHEET: https://www.ti.com/lit/ds/symlink/ina219.pdf?ts=1746203207020&ref_url=https%253A%252F%252Fwww.ti.com%252Fproduct%252FINA219%253Futm_source%253Dgoogle%2526utm_medium%253Dcpc%2526utm_campaign%253Dasc-amps-null-44700045336317113_prodfolderdynamic-cpc-pf-google-ww_en_int%2526utm_content%253Dprodfolddynamic%2526ds_k%253DDYNAMIC+SEARCH+ADS%2526DCM%253Dyes%2526gad_source%253D1%2526gad_campaignid%253D6465287935%2526gbraid%253D0AAAAAC068F29A-VFUfql4RGIMSgS5JF2z%2526gclid%253DCj0KCQjw2tHABhCiARIsANZzDWoEXFkzyL_LeVAGcFnL_-XGNWpvMIarUVX6O9OTsjwf9O46oUFWObgaAqp2EALw_wcB%2526gclsrc%253Daw.ds
IC26 = ds_ic_mcu:RP2040
IC27 = ds_ic_memory:W25Q128JV: 3V 128M-BIT SERIAL FLASH MEMORY WITH DUAL/QUAD SPI & QPI & DTR
IC28 = ds_ic_opa:MCP6001RT: 1 MHz, Low-Power Op Amp
IC29 = ds_ic_memory:CAT24C256: The CAT24C256 is a EEPROM Serial 256−Kb I2C, internally organized as 32,768 words of 8 bits each. It features a 64−byte page write buffer and supports the Standard (100 kHz), Fast (400 kHz) and Fast−Plus (1 MHz) I2C protocol. Write operations can be inhibited by taking the WP pin High (this protects the entire memory). External address pins make it possible to address up to eight CAT24C256 devices on the same bus. On−Chip ECC (Error Correction Code) makes the device suitable for high reliability applications.
IC38 = ds_ic_peripherals:TCA9548A: TCA9548A Low-Voltage 8-Channel I2C Switch with Reset; DATASHEET: https://www.ti.com/lit/ds/symlink/tca9548a.pdf
IC39 = ds_ic_peripherals:W5500: The W5500 chip is a Hardwired TCP/IP embedded Ethernet controller that provides easier Internet connection to embedded systems. W5500 enables users to have the Internet connectivity in their applications just by using the single chip in which TCP/IP stack, 10/100 Ethernet MAC and PHY embedded. WIZnet‘s Hardwired TCP/IP is the market-proven technology that supports TCP, UDP, IPv4, ICMP, ARP, IGMP, and PPPoE protocols. W5500 embeds the 32Kbyte internal memory buffer for the Ethernet packet processing. If you use W5500, you can implement the Ethernet application just by adding the simple socket program. It’s faster and easier way rather than using any other Embedded Ethernet solution. Users can use 8 independent hardware sockets simultaneously. SPI (Serial Peripheral Interface) is provided for easy integration with the external MCU. The W5500’s SPI supports 80 MHz speed and new efficient SPI protocol for the high speed network communication. In order to reduce power consumption of the system, W5500 provides WOL (Wake on LAN) and power down mode.
IC40 IC43 IC45 = ds_ic_vreg:MP2315: Description The MP2315 is a high frequency synchronous rectified step-down switch mode converter with built in internal power MOSFETs. It offers a very compact solution to achieve 3A continuous output current over a wide input supply range with excellent load and line regulation. The MP2315 has synchronous mode operation for higher efficiency over output current load range. Current mode operation provides fast transient response and eases loop stabilization. Full protection features include OCP and thermal shut down.; DATASHEET: https://www.monolithicpower.com/en/documentview/productdocument/index/version/2/document_type/Datasheet/lang/EN/sku/MP2315S?srsltid=AfmBOoqbTpEIx6KSoiWl4ZUQnKkVQGj573Ur79inB-ZmXjzR-CZxOYOr
IC42 = ds_ic_peripherals:MCP23017: 16-Bit I2C I/O Expander with Serial Interface
J8 = Wurth_Connectors_WR-TBL Rising Cage Clamp:691244510006: WR-TBL Serie 2445 - 5.08 mm Horizontal Entry Modular w. Rising Cage Clamp KIND PROPERTIES Pitch 5.08 mm MATERIAL PROPERTIES Insulator Material PA66 Insulator Flammability Rating UL94 V-0 Contact Material Copper Alloy Contact Plating Tin over Nickel Terminal Screw Material Steel Terminal Screw Plating Zinc Wire Guard Material Copper Alloy GENERAL INFORMATION Operating Temperature -30 up to +120 °C Compliance RoHS ELECTRICAL PROPERTIES IR cULus 16 A IR VDE 24 A Working Voltage [cULus] 300 V (AC) Working Voltage [VDE] 450 V (AC) Withstanding Voltage [cULus] 1600 V (AC) Withstanding Voltage [VDE] 2500 V (AC) Contact Resistance [cULus] 20 mΩ Contact Resistance [VDE] 20 mΩ MECHANICAL PROPERTIES Wire Strip Length 6 Screw M3 CERTIFICATION cULus Approval E150931 VDE Approval 40015450 PACKAGING PROPERTIES Packaging Box <https://www.we-online.com/catalog/media/o60835v209%20Family_TBL_5_08_2445_HORIZONTAL_CABLE_ENTRY_W_RISING_CAGE_6912445100xx.jpg> Details see: https://www.we-online.com/catalog/en/TBL_5_08_2445_HORIZONTAL_CABLE_ENTRY_W_RISING_CAGE_6912445100xx/ Updated by Ella Wu 2019-11-26 2019(C) Wurth Elektronik; IR-UL: 16A; IR-VDE: 24A; PART-NUMBER: 691244510006; PINS: 6; PITCH: 5.08mm; TYPE: Horizontal; WIRE: 12 to 30 (AWG) 3.31 to 0.0509 (mm²); WORKING-VOLTAGE-UL: 300V (AC); WORKING-VOLTAGE-VDE: 450V (AC)
L2-L9 = Wurth_Power Magnetics_WE-PD:WE-PD_1280: WE-PD SMT Power Inductor Characteristics AECQ 200 Qualified Ultra low RDC and RAC Highest possible saturation current based on Ferrite Suitable for switching frequency up to 10MHz Temperature dependent parameter available on Redexpert Operating Temperature from -40°C to +125°C / +150°C Types WE-PD: Since always with low loss material, tight tolerances and high saturation behavior compared to other manufacturers in the market WE-PD Robust: Plastic base improves the mechanical stability and efficiency WE-PD Performance: MnZn core improves Saturation and RDC for highest efficiency Applications Switch Mode Power supplies from 0,1W up to 300W Integrated DC DC Converter Ideal for Switch Mode Power supplies with extreme high efficiency (>95%) <https://www.we-online.com/components/media/o194227v209%20Family_WE-PD.jpg> Details see: www.we-online.com/en/components/products/WE-PD Updated by Ella Wu 2023-02-17 2023 (C) Wurth Elektronik; DATASHEET-URL: https://www.we-online.com/redexpert/spec/74477004?ae; FRES: 31.2MHz; IR: 9.5A; ISAT: 11A; MOUNT: SMT; PART-NUMBER: 74477004; RDC-MAX: 12mohm; RDC-TYP: 9mohm; SIZE: 1280; VALUE: 4.7uH; VERSION: Standard
L10 R1-R23 R46-R206 R208-R214 R218-R224 R226-R252 R254-R275 RFB3 RFB4 RFB7 RFB8 RFB11 RFB12 RT1 RT3 RT5 = ds_passive:R
L11 L13 L15 = ds_passive:L
PORT1-PORT8 = ds_con:632722100213: WR-COM USB Power Delivery Type C Receptacle Horizontal SMT General Information Operating Temperature -40 °C up to +85 °C Durability 10 000 Mating cycles Gender Receptacle Type Horizontal Electrical Properties Working Voltage 48 V (DC) Withstanding Voltage 100 V (AC) Contact Resistance 40 mΩ Material Properties Insulator Material LCP Insulator Flammability Rating UL94 V-0 Insulator Color Black Contact Material Brass Contact Plating Selective Gold Shielding Material Steel Shielding Plating Nickel <https://www.we-online.com/catalog/media/o785209v209%20Multi-WR-USB31-632722100213.jpg> Details see: www.we-online.com/en/components/products/WR_COM_USB_POWER_DELIVERY_TYPE_C_RECEPTACLE_HORIZONTAL_SMT <www.we-online.com/catalog/WR_COM_USB_POWER_DELIVERY_TYPE_C_RECEPTACLE_HORIZONTAL_SMT/?utm_source=eagle_model&utm_medium=description_link&utm_campaign=eisos_eagle> Created by Ella Wu 2024-03-08 2024 (C) Würth Elektronik; APPLICATION: USB Power Delivery; DATASHEET-URL: https://www.we-online.com/redexpert/spec/632722100213?ae; GERDER: Receptacle; INTERFACE-TYPE: Type C; IR: 5A; MOUNT: SMT; PACKAGING: Tape and Reel; PART-NUMBER: 632722100213; PINS: 6; TYPE: Horizontal; WORKING-VOLTAGE: 48V(DC)
R207 R253 = Resistor Array:742C083103JP: RES ARRAY 4 RES 10K OHM 1206 Manufacturer's datasheet <https://www.ctscorp.com/wp-content/uploads/74x.pdf>; CREATED_BY: PCBLayout.com; DIGIKEY_PN: 742C083103JPTR-ND; MANUFACTURER: CTS Resistor Products; MPN: 742C083103JP; PACKAGE: 1206
R215-R217 = Resistor Array:YC164-JR-0733RL: RES ARRAY 4 RES 33 OHM 1206 Manufacturer's datasheet <https://www.yageo.com/upload/media/product/productsearch/datasheet/rchip/PYu-YC_TC_group_51_RoHS_L_9.pdf>; CREATED_BY: PCBLayout.com; DIGIKEY_PN: YC164J-33TR-ND; MANUFACTURER: Yageo; MPN: YC164-JR-0733RL; PACKAGE: 1206
REF1 = ds_ic_vreg:LM4040BXX: Fixed voltage, 45-µA, precision micropower shunt voltage reference
T6-T8 T11-T13 T16-T18 T21-T23 T26-T28 T31-T33 T36-T38 T41-T43 = ds_active:DMP3013SFV-7; DATASHEET: https://www.diodes.com/assets/Datasheets/DMP3013SFV.pdf; MANUFACTURER_PART_NUMBER: DMP3013SFV-7; MFR_NAME: Diodes Inc
T9 T10 T14 T15 T19 T20 T24 T25 T29 T30 T34 T35 T39 T40 T44 T45 = ds_active:IPZ40N04S5L7R4ATMA1; COPYRIGHT: Copyright (C) 2025 Ultra Librarian. All rights reserved.; DATASHEET: https://www.infineon.com/dgdl/Infineon-IPZ40N04S5L-7R4-DS-v01_00-EN.pdf?fileId=5546d4624cb7f111014d6601321448a0; MANUFACTURER_PART_NUMBER: IPZ40N04S5L7R4ATMA1; MFR_NAME: Infineon
USB9 = ds_con:USB_C
USBA_1-2 USBA_3-4 = Wurth_Connectors_WR-USB:61400826021: WR-COM USB 2.0 Type A Horizontal Dual Stacked Kind Properties Durability:1 500 Mating cycles Quality Class:1 500 Mating cycles Connector Type:USB Gender:Receptacle Type:Stacked Horizontal General Information Operating Temperature:-40up to +105 °C Compliance:RoHS Electrical Properties IR 1:1.5 A Working Voltage:30V (AC) Withstanding Voltage:750 V (AC) Contact Resistance:20 mΩ Material Properties Insulator Material:PBT Insulator Flammability Rating:UL94 V-0 Color:White Cover Material:Brass Cover Plating:Nickel Contact Material:Copper Alloy Contact Plating:Selective Gold Contact Type:Stamped Shielding Material:Brass Shielding Plating:Nickel <https://www.we-online.com/catalog/media/o32989v209%20Family_WR-COM_61400826021.jpg> Details see: https://www.we-online.com/catalog/en/COM_TYPE_A_HORIZONTAL_DUAL_STACKED/ Updated by Yingchun, Shan 2020-01-14 2020 (C) Würth Elektronik; APPLICATION: USB 2.0; DATASHEET-URL: https://www.we-online.com/redexpert/spec/61400826021?ae; GERDER: Receptacle; INTERFACE-TYPE: Type A; IR: 1.5A; MOUNT: THT; PACKAGING: Tray; PART-NUMBER: 61400826021; PINS: 8; TYPE: Stacked Horizontal; WORKING-VOLTAGE: 30V(AC)
VUSBA1-VUSBA4 = testpad:TP: Test pad
X1 = Wurth_Quartz Crystals & Oscillators_WE-XTAL:WE-XTAL_CFPX-180: WE-XTAL Quartz Crystal Characteristics SMT and THT models Hermetically sealed Frequencies between 1.8432 MHz and 50 MHz Tolerances down to ±10 ppm available Maximum operating temperatures range: -40 °C to 85 °C Stabilities down to ±10 ppm available Applications Microprocessor Wireless Communication Devices Industrial Devices Wired Communication (e.g. Ethernet and USB) IoT Optical Network Audio and Multimedia Devices Test and Measurement Equipment Navigation and Locators Wearables <https://www.we-online.com/catalog/media/o135919v209%20Family_WE-XTAL_IQXC-42.jpg> Details see: https://www.we-online.com/catalog/en/WE-XTAL Updated by Ella Wu , 2020-11-23 2020 (C) Wurth Elektronik; C-LOAD: 18pF; DATASHEET-URL: https://www.we-online.com/catalog/datasheet/830055295.pdf; MOUNT: SMT; PART-NUMBER: 830055295; STABILITY: 30ppm; TOLERANCE: ±20ppm; VALUE: 12MHz
X2 = Wurth_Quartz Crystals & Oscillators_WE-XTAL:WE-XTAL_CFPX-180: WE-XTAL Quartz Crystal Characteristics SMT and THT models Hermetically sealed Frequencies between 1.8432 MHz and 50 MHz Tolerances down to ±10 ppm available Maximum operating temperatures range: -40 °C to 85 °C Stabilities down to ±10 ppm available Applications Microprocessor Wireless Communication Devices Industrial Devices Wired Communication (e.g. Ethernet and USB) IoT Optical Network Audio and Multimedia Devices Test and Measurement Equipment Navigation and Locators Wearables <https://www.we-online.com/catalog/media/o135919v209%20Family_WE-XTAL_IQXC-42.jpg> Details see: https://www.we-online.com/catalog/en/WE-XTAL Updated by Ella Wu , 2020-11-23 2020 (C) Wurth Elektronik; C-LOAD: 16pF; DATASHEET-URL: https://www.we-online.com/catalog/datasheet/830035268.pdf; MOUNT: SMT; PART-NUMBER: 830035268; STABILITY: 50ppm; TOLERANCE: ±50ppm; VALUE: 25MHz

## Net classes
0 default: width 0.2 mm, drill 0.15 mm, clearance 0.178 mm
1 100R_DIFFPAIR: width 0.121 mm, drill 0.15 mm, clearance 0.191 mm
2 90R_DIFFPAIR: width 0.155 mm, drill 0.15 mm, clearance 0.191 mm